# EAGLE schematic PWM_ATUC64L4U (EAGLE 5.11)

## Sheet 1 of 4
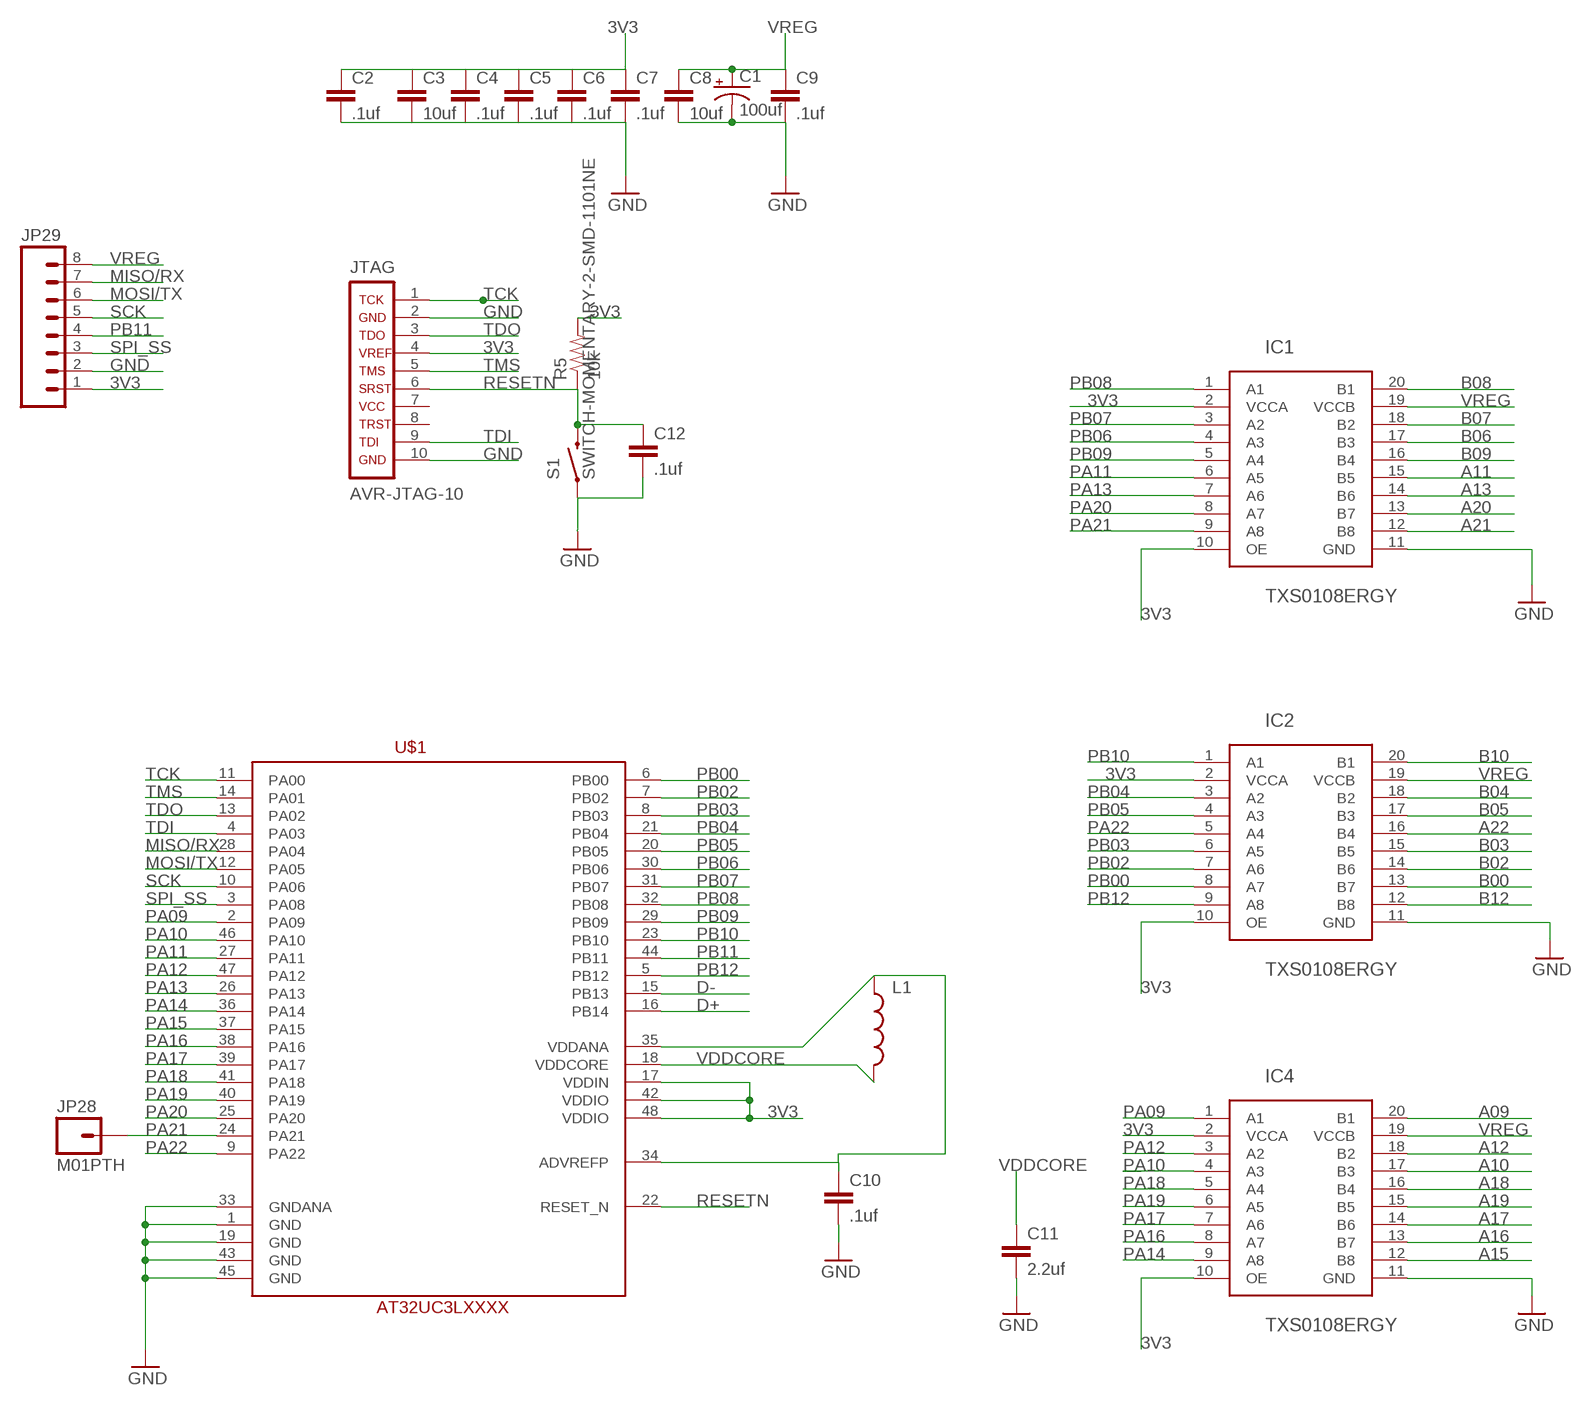
[diagram p0: schematic, sheet 1]

### Parts
C1  100uf  CAP_POL7343  [EIA7343]
C2  .1uf  CAP0805  [0805]
C3  10uf  CAP0805  [0805]
C4  .1uf  CAP0805  [0805]
C5  .1uf  CAP0805  [0805]
C6  .1uf  CAP0805  [0805]
C7  .1uf  CAP0805  [0805]
C8  10uf  CAP0805  [0805]
C9  .1uf  CAP0805  [0805]
C10  .1uf  CAP0805  [0805]
C11  2.2uf  CAP0805  [0805]
C12  .1uf  CAP0805  [0805]
IC1  TXS0108ERGY  [RGY]
IC2  TXS0108ERGY  [RGY]
IC4  TXS0108ERGY  [RGY]
JP28  M01PTH  [1X01]
JP29  M081X08  [1X08]
JTAG  AVR-JTAG-10  [AVR-JTAG-10]
L1  INDUCTOR0805  [0805]
R5  10k  RESISTOR0805-RES  [0805]
S1  SWITCH-MOMENTARY-2-SMD-1101NE  [TACTILE-SWITCH-1101NE]
U$1  ATUCXXXL4U  [TQFP48]

### Nets
3V3: C2.1 C3.1 C4.1 C5.1 C6.1 C7.1 IC1.2(VCCA) IC1.10(OE) IC2.2(VCCA) IC2.10(OE) IC4.2(VCCA) IC4.10(OE) JP29.1 JTAG.4 R5.2 U$1.17(VDDIN) U$1.42(VDDIO) U$1.48(VDDIO) ; also sheet 4
A09: IC4.20(B1) ; also sheet 2
A10: IC4.17(B3) ; also sheet 2
A11: IC1.15(B5) ; also sheet 2
A12: IC4.18(B2) ; also sheet 2
A13: IC1.14(B6) ; also sheet 2
A15: IC4.12(B8) ; also sheet 2
A16: IC4.13(B7) ; also sheet 2
A17: IC4.14(B6) ; also sheet 2
A18: IC4.16(B4) ; also sheet 2
A19: IC4.15(B5) ; also sheet 2
A20: IC1.13(B7) ; also sheet 2
A21: IC1.12(B8) ; also sheet 2
A22: IC2.16(B4) ; also sheet 2
B00: IC2.13(B7) ; also sheet 2
B02: IC2.14(B6) ; also sheet 2
B03: IC2.15(B5) ; also sheet 2
B04: IC2.18(B2) ; also sheet 2
B05: IC2.17(B3) ; also sheet 2
B06: IC1.17(B3) ; also sheet 2
B07: IC1.18(B2) ; also sheet 2
B08: IC1.20(B1) ; also sheet 2
B09: IC1.16(B4) ; also sheet 2
B10: IC2.20(B1) ; also sheet 2
B12: IC2.12(B8) ; also sheet 2
D+: U$1.16(PB14) ; also sheet 3
D-: U$1.15(PB13) ; also sheet 3
GND: C1.C(-) C2.2 C3.2 C4.2 C5.2 C6.2 C7.2 C8.2 C9.2 C10.2 C11.2 C12.2 IC1.11(GND) IC2.11(GND) IC4.11(GND) JP29.2 JTAG.2 JTAG.10 S1.P$1 U$1.1(GND) U$1.19(GND) U$1.33(GNDANA) U$1.43(GND) U$1.45(GND) ; also sheet 2,3,4
MISO/RX: JP29.7 U$1.28(PA04)
MOSI/TX: JP29.6 U$1.12(PA05)
PA09: IC4.1(A1) U$1.2(PA09)
PA10: IC4.4(A3) U$1.46(PA10)
PA11: IC1.6(A5) U$1.27(PA11)
PA12: IC4.3(A2) U$1.47(PA12)
PA13: IC1.7(A6) U$1.26(PA13)
PA14: IC4.9(A8) U$1.36(PA14)
PA15: U$1.37(PA15) ; also sheet 3
PA16: IC4.8(A7) U$1.38(PA16)
PA17: IC4.7(A6) U$1.39(PA17)
PA18: IC4.5(A4) U$1.41(PA18)
PA19: IC4.6(A5) U$1.40(PA19)
PA20: IC1.8(A7) U$1.25(PA20)
PA21: IC1.9(A8) JP28.1 U$1.24(PA21)
PA22: IC2.5(A4) U$1.9(PA22)
PB00: IC2.8(A7) U$1.6(PB00)
PB02: IC2.7(A6) U$1.7(PB02)
PB03: IC2.6(A5) U$1.8(PB03)
PB04: IC2.3(A2) U$1.21(PB04)
PB05: IC2.4(A3) U$1.20(PB05)
PB06: IC1.4(A3) U$1.30(PB06)
PB07: IC1.3(A2) U$1.31(PB07)
PB08: IC1.1(A1) U$1.32(PB08)
PB09: IC1.5(A4) U$1.29(PB09)
PB10: IC2.1(A1) U$1.23(PB10)
PB11: JP29.4 U$1.44(PB11)
PB12: IC2.9(A8) U$1.5(PB12)
RESETN: C12.1 JTAG.6 R5.1 S1.P$2 U$1.22(RESET_N)
SCK: JP29.5 U$1.10(PA06)
SPI_SS: JP29.3 U$1.3(PA08)
TCK: JTAG.1 U$1.11(PA00)
TDI: JTAG.9 U$1.4(PA03)
TDO: JTAG.3 U$1.13(PA02)
TMS: JTAG.5 U$1.14(PA01)
VDDCORE: C11.1 L1.2 U$1.18(VDDCORE)
VREF: C10.1 L1.1 U$1.34(ADVREFP) U$1.35(VDDANA)
VREG: C1.A(+) C8.1 C9.1 IC1.19(VCCB) IC2.19(VCCB) IC4.19(VCCB) JP29.8 ; also sheet 2,4
Unconnected: JTAG.7 JTAG.8

## Sheet 2 of 4
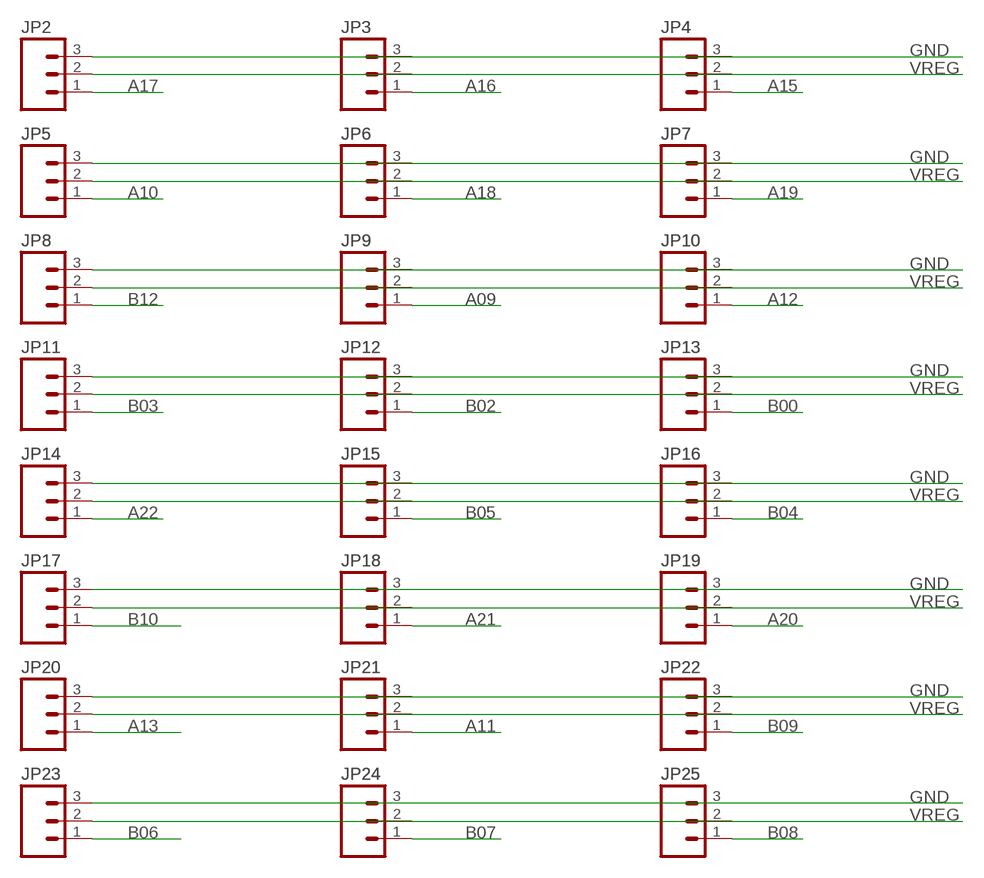
[diagram p1: schematic, sheet 2]

### Parts
JP2  M03PTH  [1X03]
JP3  M03PTH  [1X03]
JP4  M03PTH  [1X03]
JP5  M03PTH  [1X03]
JP6  M03PTH  [1X03]
JP7  M03PTH  [1X03]
JP8  M03PTH  [1X03]
JP9  M03PTH  [1X03]
JP10  M03PTH  [1X03]
JP11  M03PTH  [1X03]
JP12  M03PTH  [1X03]
JP13  M03PTH  [1X03]
JP14  M03PTH  [1X03]
JP15  M03PTH  [1X03]
JP16  M03PTH  [1X03]
JP17  M03PTH  [1X03]
JP18  M03PTH  [1X03]
JP19  M03PTH  [1X03]
JP20  M03PTH  [1X03]
JP21  M03PTH  [1X03]
JP22  M03PTH  [1X03]
JP23  M03PTH  [1X03]
JP24  M03PTH  [1X03]
JP25  M03PTH  [1X03]

### Nets
A09: JP9.1 ; also sheet 1
A10: JP5.1 ; also sheet 1
A11: JP21.1 ; also sheet 1
A12: JP10.1 ; also sheet 1
A13: JP20.1 ; also sheet 1
A15: JP4.1 ; also sheet 1
A16: JP3.1 ; also sheet 1
A17: JP2.1 ; also sheet 1
A18: JP6.1 ; also sheet 1
A19: JP7.1 ; also sheet 1
A20: JP19.1 ; also sheet 1
A21: JP18.1 ; also sheet 1
A22: JP14.1 ; also sheet 1
B00: JP13.1 ; also sheet 1
B02: JP12.1 ; also sheet 1
B03: JP11.1 ; also sheet 1
B04: JP16.1 ; also sheet 1
B05: JP15.1 ; also sheet 1
B06: JP23.1 ; also sheet 1
B07: JP24.1 ; also sheet 1
B08: JP25.1 ; also sheet 1
B09: JP22.1 ; also sheet 1
B10: JP17.1 ; also sheet 1
B12: JP8.1 ; also sheet 1
GND: JP2.3 JP3.3 JP4.3 JP5.3 JP6.3 JP7.3 JP8.3 JP9.3 JP10.3 JP11.3 JP12.3 JP13.3 JP14.3 JP15.3 JP16.3 JP17.3 JP18.3 JP19.3 JP20.3 JP21.3 JP22.3 JP23.3 JP24.3 JP25.3 ; also sheet 1,3,4
VREG: JP2.2 JP3.2 JP4.2 JP5.2 JP6.2 JP7.2 JP8.2 JP9.2 JP10.2 JP11.2 JP12.2 JP13.2 JP14.2 JP15.2 JP16.2 JP17.2 JP18.2 JP19.2 JP20.2 JP21.2 JP22.2 JP23.2 JP24.2 JP25.2 ; also sheet 1,4

## Sheet 3 of 4
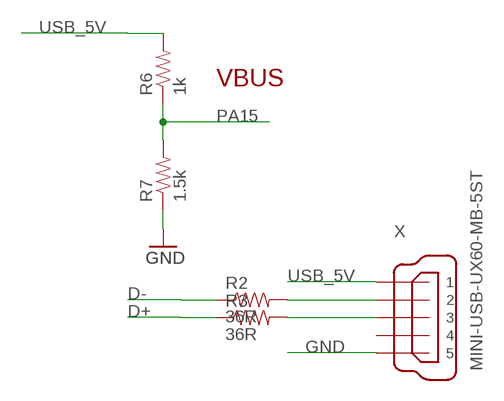
[diagram p2: schematic, sheet 3]

### Parts
R2  36R  RESISTOR0805-RES  [0805]
R3  36R  RESISTOR0805-RES  [0805]
R6  1k  RESISTOR0805-RES  [0805]
R7  1.5k  RESISTOR0805-RES  [0805]
X  MINI-USB-UX60-MB-5ST  [UX60-MB-5ST]

### Nets
D+: R3.1 ; also sheet 1
D-: R2.1 ; also sheet 1
GND: R7.1 X.5 ; also sheet 1,2,4
N$7: R2.2 X.2
N$8: R3.2 X.3
PA15: R6.1 R7.2 ; also sheet 1
USB_5V: R6.2 X.1
Unconnected: X.4

### Notes on the sheet
- VBUS

## Sheet 4 of 4
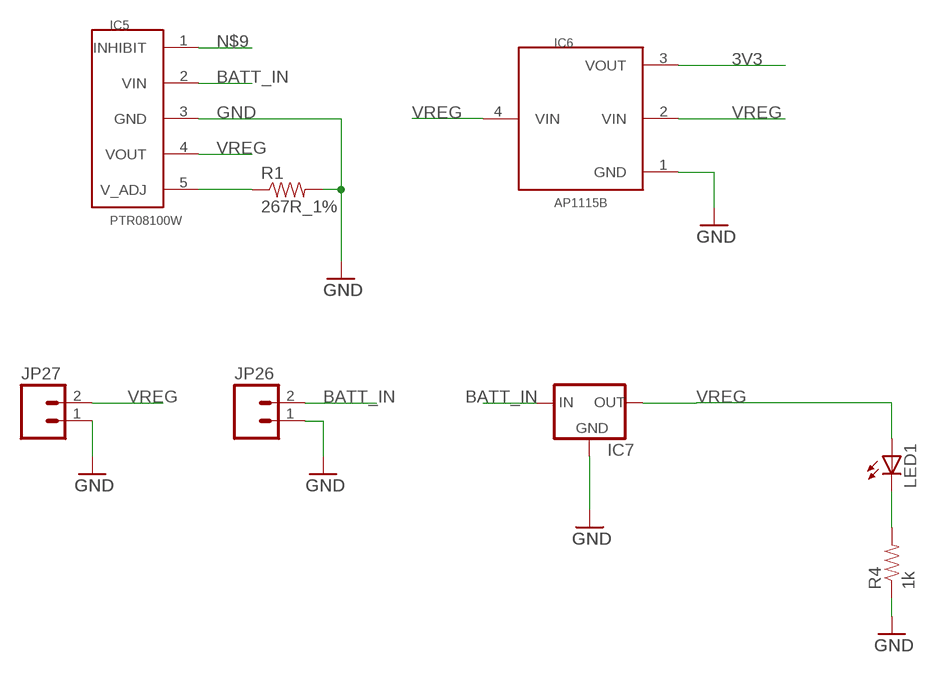
[diagram p3: schematic, sheet 4]

### Parts
IC5  PTR08100W  SLTS284ETI  [SLTS284E]
IC6  AP1115B  AP1115  [SOT89-3L]
IC7  V-REG-3_LM1117  [V-REG-3_SOT223]
JP26  M023.5MM  [SCREWTERMINAL-3.5MM-2]
JP27  M023.5MM  [SCREWTERMINAL-3.5MM-2]
LED1  LEDCHIPLED_1206  [CHIPLED_1206]
R1  267R_1%  RESISTOR0805-RES  [0805]
R4  1k  RESISTOR0805-RES  [0805]

### Nets
3V3: IC6.3(VOUT) ; also sheet 1
BATT_IN: IC5.2(VIN) IC7.3(IN) JP26.2
GND: IC5.3(GND) IC6.1(GND) IC7.1(GND) JP26.1 JP27.1 R1.2 R4.1 ; also sheet 1,2,3
N$5: IC5.5(V_ADJ) R1.1
N$9: IC5.1(INHIBIT)
N$10: LED1.C R4.2
VREG: IC5.4(VOUT) IC6.2(VIN) IC6.4(VIN) IC7.2(OUT) JP27.2 LED1.A ; also sheet 1,2

## Library data of the parts
C1 = SparkFun:CAP_POL: Capacitor Polarized These are standard SMD and PTH capacitors. Normally 10uF, 47uF, and 100uF in electrolytic and tantalum varieties. Always verify the external diameter of the through hole cap, it varies with capacity, voltage, and manufacturer. The EIA devices should be standard.
C2-C12 = SparkFun:CAP: Capacitor Standard 0603 ceramic capacitor, and 0.1" leaded capacitor.
IC1 IC2 IC4 = PWM_ATUC64L4U:TXS0108E
IC5 = PWM:SLTS284E
IC6 = PWM:AP1115
IC7 = avrcanbus:V-REG-3_LM1117
JP2-JP25 = Speaker_shield:M03: Header 3 Standard 3-pin 0.1" header. Use with straight break away headers (SKU : PRT-00116), right angle break away headers (PRT-00553), swiss pins (PRT-00743), machine pins (PRT-00117), and female headers (PRT-00115). Molex polarized connector foot print use with SKU : PRT-08232 with associated crimp pins and housings.
JP26 JP27 = SparkFun:M02: Header 2 Standard 2-pin 0.1" header. Use with straight break away headers (SKU : PRT-00116), right angle break away headers (PRT-00553), swiss pins (PRT-00743), machine pins (PRT-00117), and female headers (PRT-00115). Molex polarized connector foot print use with SKU : PRT-08233 with associated crimp pins and housings.
JP28 = SparkFun:M01: Header 1 Standard 1-pin 0.1" header. Use with straight break away headers (SKU : PRT-00116), right angle break away headers (PRT-00553), swiss pins (PRT-00743), machine pins (PRT-00117), and female headers (PRT-00115).
JP29 = SparkFun:M08: Header 8 Standard 8-pin 0.1" header. Use with straight break away headers (SKU : PRT-00116), right angle break away headers (PRT-00553), swiss pins (PRT-00743), machine pins (PRT-00117), and female headers (PRT-00115).
JTAG = atmel-avr32-michel:AVR-JTAG-10: AVR JTAG Debug/Programming Header
L1 = SparkFun:INDUCTOR: Inductors Basic Inductor/Choke - 0603 and 1206. Footprints are not proven and vary greatly between part numbers.
LED1 = led:LED: LED OSRAM: - CHIPLED LG R971, LG N971, LY N971, LG Q971, LY Q971, LO R971, LY R971 LH N974, LH R974 LS Q976, LO Q976, LY Q976 LO Q996 - Hyper CHIPLED LW Q18S LB Q993, LB Q99A, LB R99A - SideLED LS A670, LO A670, LY A670, LG A670, LP A670 LB A673, LV A673, LT A673, LW A673 LH A674 LY A675 LS A676, LA A676, LO A676, LY A676, LW A676 LS A679, LY A679, LG A679 - Hyper Micro SIDELED® LS Y876, LA Y876, LO Y876, LY Y876 LT Y87S - SmartLED LW L88C, LW L88S LB L89C, LB L89S, LG L890 LS L89K, LO L89K, LY L89K LS L896, LA L896, LO L896, LY L896 - TOPLED LS T670, LO T670, LY T670, LG T670, LP T670 LSG T670, LSP T670, LSY T670, LOP T670, LYG T670 LG T671, LOG T671, LSG T671 LB T673, LV T673, LT T673, LW T673 LH T674 LS T676, LA T676, LO T676, LY T676, LB T676, LH T676, LSB T676, LW T676 LB T67C, LV T67C, LT T67C, LS T67K, LO T67K, LY T67K, LW E67C LS E67B, LA E67B, LO E67B, LY E67B, LB E67C, LV E67C, LT E67C LW T67C LS T679, LY T679, LG T679 LS T770, LO T770, LY T770, LG T770, LP T770 LB T773, LV T773, LT T773, LW T773 LH T774 LS E675, LA E675, LY E675, LS T675 LS T776, LA T776, LO T776, LY T776, LB T776 LHGB T686 LT T68C, LB T68C - Hyper Mini TOPLED® LB M676 - Mini TOPLED Santana® LG M470 LS M47K, LO M47K, LY M47K Source: http://www.osram.convergy.de LUXEON: - LUMILED® LXK2-PW12-R00, LXK2-PW12-S00, LXK2-PW14-U00, LXK2-PW14-V00 LXK2-PM12-R00, LXK2-PM12-S00, LXK2-PM14-U00 LXK2-PE12-Q00, LXK2-PE12-R00, LXK2-PE12-S00, LXK2-PE14-T00, LXK2-PE14-U00 LXK2-PB12-K00, LXK2-PB12-L00, LXK2-PB12-M00, LXK2-PB14-N00, LXK2-PB14-P00, LXK2-PB14-Q00 LXK2-PR12-L00, LXK2-PR12-M00, LXK2-PR14-Q00, LXK2-PR14-R00 LXK2-PD12-Q00, LXK2-PD12-R00, LXK2-PD12-S00 LXK2-PH12-R00, LXK2-PH12-S00 LXK2-PL12-P00, LXK2-PL12-Q00, LXK2-PL12-R00 Source: www.luxeon.com KINGBRIGHT: KA-3528ASYC Source: www.kingbright.com
R1-R7 = SparkFun:RESISTOR: Resistor Basic schematic elements and footprints for 0603, 1206, and PTH resistors.
S1 = table_tiles_tlc:SWITCH-MOMENTARY-2
U$1 = atmel-avr32-michel:ATUCXXXL4U
X = con-hirose:MINI-USB-: MINI USB Connector Source: http://www.hirose.co.jp/cataloge_hp/e24000019.pdf; OC_FARNELL: unknown; OC_NEWARK: unknown